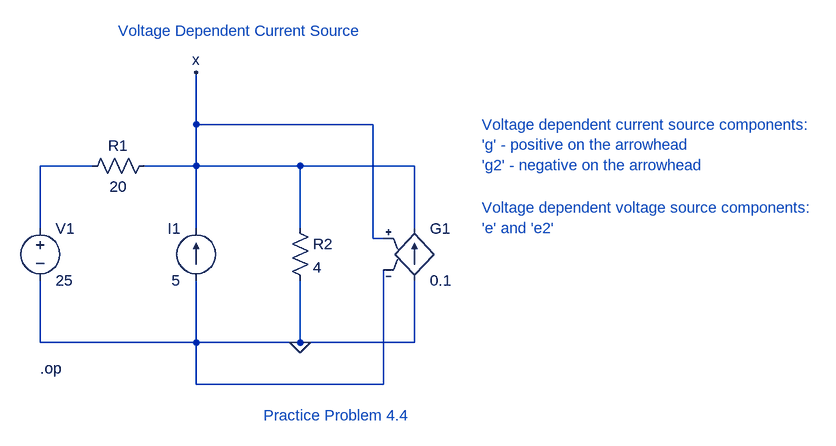
[diagram p0: schematic 4.4 Voltage Dependent Current Source.asc]
4.4 Voltage Dependent Current Source.asc, the LTspice schematic file:
Version 4
SHEET 1 1284 680
WIRE 224 16 224 -64
WIRE 496 16 224 16
WIRE 64 80 -16 80
WIRE 224 80 224 16
WIRE 224 80 144 80
WIRE 384 80 224 80
WIRE 560 80 384 80
WIRE -16 176 -16 80
WIRE 224 176 224 80
WIRE 384 176 384 80
WIRE 560 176 560 80
WIRE 496 192 496 16
WIRE 512 192 496 192
WIRE -16 352 -16 256
WIRE 224 352 224 256
WIRE 224 352 -16 352
WIRE 384 352 384 256
WIRE 384 352 224 352
WIRE 560 352 560 256
WIRE 560 352 384 352
WIRE 224 416 224 352
WIRE 512 416 512 240
WIRE 512 416 224 416
FLAG 384 352 0
FLAG 224 -64 x
SYMBOL res 160 64 R90
WINDOW 0 0 56 VBottom 2
WINDOW 3 32 56 VTop 2
SYMATTR InstName R1
SYMATTR Value 20
SYMBOL voltage -16 160 R0
SYMATTR InstName V1
SYMATTR Value 25
SYMBOL current 224 256 R180
WINDOW 0 24 80 Left 2
WINDOW 3 24 0 Left 2
SYMATTR InstName I1
SYMATTR Value 5
SYMBOL res 368 160 R0
SYMATTR InstName R2
SYMATTR Value 4
SYMBOL g 560 160 R0
SYMATTR InstName G1
SYMATTR Value 0.1
TEXT -16 392 Left 2 !.op
TEXT 104 -128 Left 2 ;Voltage Dependent Current Source
TEXT 664 16 Left 2 ;Voltage dependent current source components:\n'g' - positive on the arrowhead\n'g2' - negative on the arrowhead
TEXT 328 464 Left 2 ;Practice Problem 4.4
TEXT 664 144 Left 2 ;Voltage dependent voltage source components:\n'e' and 'e2'

The netlist it stands for:
* 4.4 Voltage Dependent Current Source.asc
R1 x N001 20
V1 N001 0 25
I1 0 x 5
R2 x 0 4
G1 0 x x 0 0.1
.op
* Voltage Dependent Current Source
* Voltage dependent current source components:
* 'g' - positive on the arrowhead
* 'g2' - negative on the arrowhead
* Practice Problem 4.4
* Voltage dependent voltage source components:
* 'e' and 'e2'
.backanno
.end